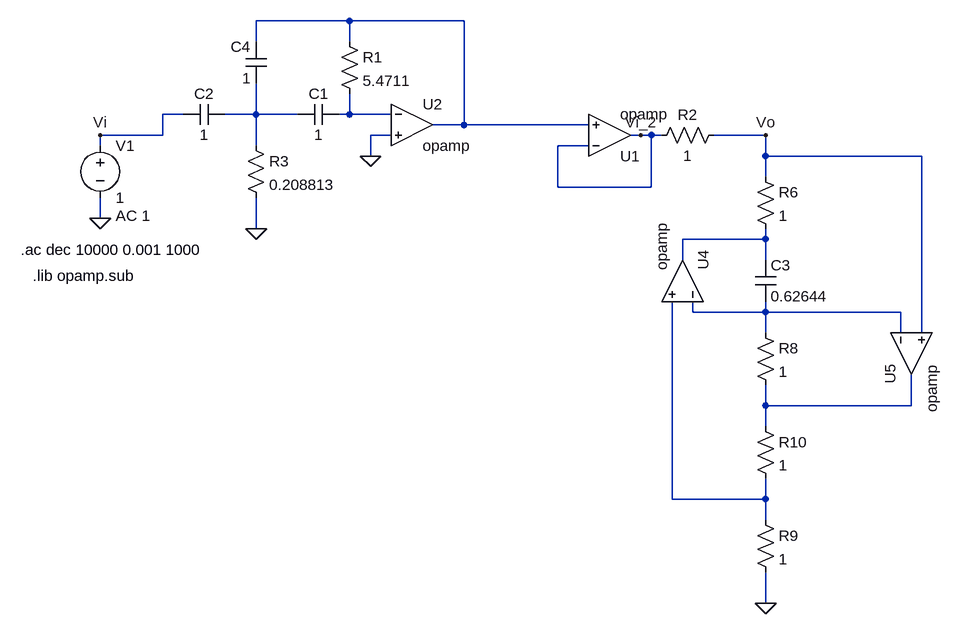
[diagram p0: schematic ts2_hpf_cheby_norm_gic_mfb.asc]
ts2_hpf_cheby_norm_gic_mfb.asc, the LTspice schematic file:
Version 4
SHEET 1 1204 980
WIRE 304 -64 160 -64
WIRE 480 -64 304 -64
WIRE 160 -32 160 -64
WIRE 304 -32 304 -64
WIRE 48 80 16 80
WIRE 160 80 160 32
WIRE 160 80 112 80
WIRE 224 80 160 80
WIRE 304 80 304 48
WIRE 304 80 288 80
WIRE 368 80 304 80
WIRE 480 96 480 -64
WIRE 480 96 432 96
WIRE 672 96 480 96
WIRE 16 112 16 80
WIRE 16 112 -80 112
WIRE 368 112 336 112
WIRE 752 112 736 112
WIRE 768 112 752 112
WIRE 784 112 768 112
WIRE 944 112 864 112
WIRE -80 128 -80 112
WIRE 160 128 160 80
WIRE 672 128 624 128
WIRE 336 144 336 112
WIRE 944 144 944 112
WIRE 1184 144 944 144
WIRE 944 176 944 144
WIRE 624 192 624 128
WIRE 768 192 768 112
WIRE 768 192 624 192
WIRE -80 240 -80 208
WIRE 160 256 160 208
WIRE 944 272 944 256
WIRE 944 272 816 272
WIRE 816 304 816 272
WIRE 944 304 944 272
WIRE 832 384 832 368
WIRE 944 384 944 368
WIRE 944 384 832 384
WIRE 1152 384 944 384
WIRE 944 416 944 384
WIRE 1152 416 1152 384
WIRE 1184 416 1184 144
WIRE 944 528 944 496
WIRE 1168 528 1168 480
WIRE 1168 528 944 528
WIRE 944 560 944 528
WIRE 800 672 800 368
WIRE 944 672 944 640
WIRE 944 672 800 672
WIRE 944 704 944 672
WIRE 944 832 944 784
FLAG -80 240 0
FLAG 944 112 Vo
FLAG -80 112 Vi
FLAG 752 112 Vi_2
FLAG 944 832 0
FLAG 336 144 0
FLAG 160 256 0
SYMBOL res 880 96 R90
WINDOW 0 0 56 VBottom 2
WINDOW 3 32 56 VTop 2
SYMATTR InstName R2
SYMATTR Value 1
SYMBOL Opamps\\opamp 704 176 M180
SYMATTR InstName U1
SYMBOL voltage -80 112 R0
WINDOW 123 24 124 Left 2
WINDOW 39 0 0 Left 0
SYMATTR InstName V1
SYMATTR Value 1
SYMATTR Value2 AC 1
SYMBOL Opamps\\opamp 880 336 M270
SYMATTR InstName U4
SYMBOL Opamps\\opamp 1104 448 M90
SYMATTR InstName U5
SYMBOL cap 928 304 R0
SYMATTR InstName C3
SYMATTR Value 0.62644
SYMBOL res 928 160 R0
SYMATTR InstName R6
SYMATTR Value 1
SYMBOL res 928 400 R0
SYMATTR InstName R8
SYMATTR Value 1
SYMBOL res 928 688 R0
SYMATTR InstName R9
SYMATTR Value 1
SYMBOL res 928 544 R0
SYMATTR InstName R10
SYMATTR Value 1
SYMBOL Opamps\\opamp 400 32 R0
SYMATTR InstName U2
SYMBOL res 288 -48 R0
SYMATTR InstName R1
SYMATTR Value 5.4711
SYMBOL res 144 112 R0
SYMATTR InstName R3
SYMATTR Value 0.208813
SYMBOL cap 288 64 R90
WINDOW 0 0 32 VBottom 2
WINDOW 3 32 32 VTop 2
SYMATTR InstName C1
SYMATTR Value 1
SYMBOL cap 112 64 R90
WINDOW 0 0 32 VBottom 2
WINDOW 3 32 32 VTop 2
SYMATTR InstName C2
SYMATTR Value 1
SYMBOL cap 176 32 R180
WINDOW 0 24 56 Left 2
WINDOW 3 24 8 Left 2
SYMATTR InstName C4
SYMATTR Value 1
TEXT -202 288 Left 2 !.ac dec 10000 0.001 1000
TEXT -184 328 Left 2 !.lib opamp.sub

The netlist it stands for:
* ts2_hpf_cheby_norm_gic_mfb.asc
R2 Vo Vi_2 1
XU1 Vi_2 N001 Vi_2 opamp Aol=100K GBW=10Meg  ; pins invin noninvin out
V1 Vi 0 1 AC 1
XU4 N005 N007 N004 opamp Aol=100K GBW=10Meg  ; pins invin noninvin out
XU5 N005 Vo N006 opamp Aol=100K GBW=10Meg  ; pins invin noninvin out
C3 N004 N005 0.62644
R6 Vo N004 1
R8 N005 N006 1
R9 N007 0 1
R10 N006 N007 1
XU2 N003 0 N001 opamp Aol=100K GBW=10Meg  ; pins invin noninvin out
R1 N001 N003 5.4711
R3 N002 0 0.208813
C1 N003 N002 1
C2 N002 Vi 1
C4 N002 N001 1
.ac dec 10000 0.001 1000
.lib opamp.sub
.backanno
.end